# Altium project APSS_BreakoutBoard.PrjPcb
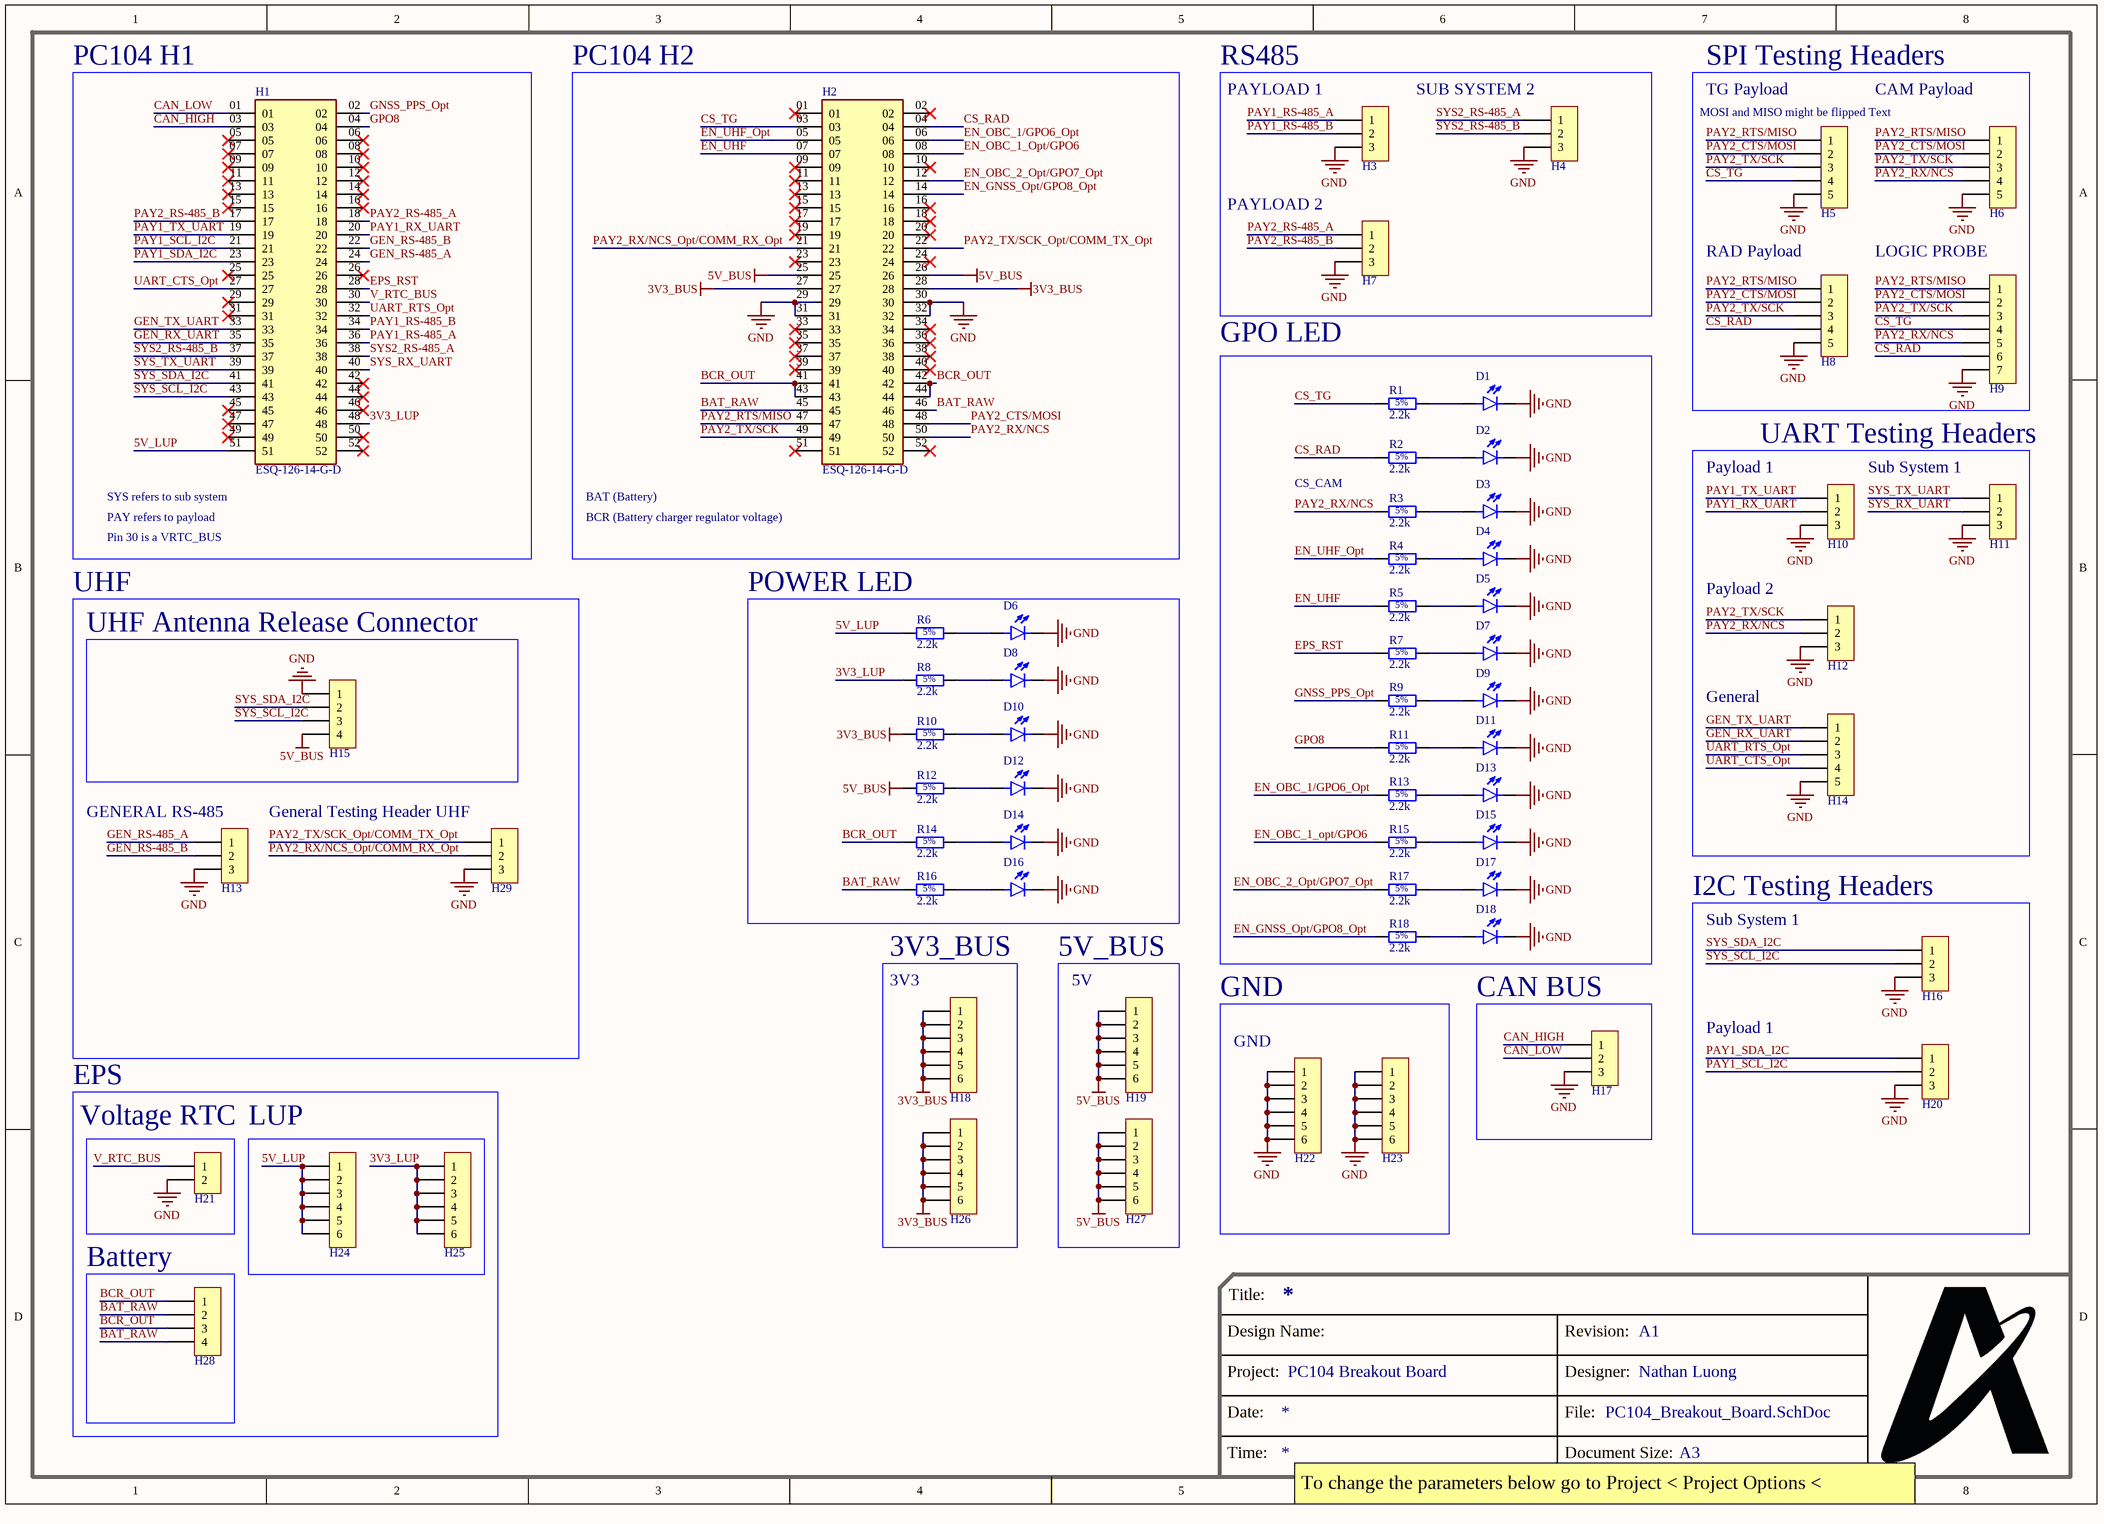
[diagram p0: PC104_Breakout_Board.SchDoc]
BoardRevision: A1; Designer: Nathan Luong; Project: PC104 Breakout Board
1 sheet, 65 parts. Net scope: global (net labels, ports and power ports of the same name join across sheets).
Board file: PC104_Breakout_Board.PcbDoc

## Sheet PC104_Breakout_Board.SchDoc
size A3; SheetNumber: 1; SheetTotal: 1

### Parts
D1  LTST-C190 Series  [LED_0603_1608M_0.80mm]  (value not drawn)
D2  LTST-C190 Series  [LED_0603_1608M_0.80mm]  (value not drawn)
D3  LTST-C190 Series  [LED_0603_1608M_0.80mm]  (value not drawn)
D4  LTST-C190 Series  [LED_0603_1608M_0.80mm]  (value not drawn)
D5  LTST-C190 Series  [LED_0603_1608M_0.80mm]  (value not drawn)
D6  LTST-C190 Series  [LED_0603_1608M_0.80mm]  (value not drawn)
D7  LTST-C190 Series  [LED_0603_1608M_0.80mm]  (value not drawn)
D8  LTST-C190 Series  [LED_0603_1608M_0.80mm]  (value not drawn)
D9  LTST-C190 Series  [LED_0603_1608M_0.80mm]  (value not drawn)
D10  LTST-C190 Series  [LED_0603_1608M_0.80mm]  (value not drawn)
D11  LTST-C190 Series  [LED_0603_1608M_0.80mm]  (value not drawn)
D12  LTST-C190 Series  [LED_0603_1608M_0.80mm]  (value not drawn)
D13  LTST-C190 Series  [LED_0603_1608M_0.80mm]  (value not drawn)
D14  LTST-C190 Series  [LED_0603_1608M_0.80mm]  (value not drawn)
D15  LTST-C190 Series  [LED_0603_1608M_0.80mm]  (value not drawn)
D16  LTST-C190 Series  [LED_0603_1608M_0.80mm]  (value not drawn)
D17  LTST-C190 Series  [LED_0603_1608M_0.80mm]  (value not drawn)
D18  LTST-C190 Series  [LED_0603_1608M_0.80mm]  (value not drawn)
H1  ESQ-126-14-G-D  [SAMTEC_ESQ-126-14-G-D]
H2  ESQ-126-14-G-D  [SAMTEC_ESQ-126-14-G-D]
H3  HDR,2.54mm,1x3  [HEADER_2.54MM_1x3PIN]  (value not drawn)  (no BOM)
H4  HDR,2.54mm,1x3  [HEADER_2.54MM_1x3PIN]  (value not drawn)  (no BOM)
H5  HDR,2.54mm,1x5  [HEADER_2.54MM_1x5PIN]  (value not drawn)  (no BOM)
H6  HDR,2.54mm,1x5  [HEADER_2.54MM_1x5PIN]  (value not drawn)  (no BOM)
H7  HDR,2.54mm,1x3  [HEADER_2.54MM_1x3PIN]  (value not drawn)  (no BOM)
H8  HDR,2.54mm,1x5  [HEADER_2.54MM_1x5PIN]  (value not drawn)  (no BOM)
H9  HDR,2.54mm,1x7  [HEADER_2.54MM_1x7PIN]  (value not drawn)  (no BOM)
H10  HDR,2.54mm,1x3  [HEADER_2.54MM_1x3PIN]  (value not drawn)  (no BOM)
H11  HDR,2.54mm,1x3  [HEADER_2.54MM_1x3PIN]  (value not drawn)  (no BOM)
H12  HDR,2.54mm,1x3  [HEADER_2.54MM_1x3PIN]  (value not drawn)  (no BOM)
H13  HDR,2.54mm,1x3  [HEADER_2.54MM_1x3PIN]  (value not drawn)  (no BOM)
H14  HDR,2.54mm,1x5  [HEADER_2.54MM_1x5PIN]  (value not drawn)  (no BOM)
H15  HDR,2.54mm,1x4  [HEADER_2.54MM_1x4PIN]  (value not drawn)  (no BOM)
H16  HDR,2.54mm,1x3  [HEADER_2.54MM_1x3PIN]  (value not drawn)  (no BOM)
H17  HDR,2.54mm,1x3  [HEADER_2.54MM_1x3PIN]  (value not drawn)  (no BOM)
H18  HDR,2.54mm,1x6  [HEADER_2.54MM_1x6PIN]  (value not drawn)  (no BOM)
H19  HDR,2.54mm,1x6  [HEADER_2.54MM_1x6PIN]  (value not drawn)  (no BOM)
H20  HDR,2.54mm,1x3  [HEADER_2.54MM_1x3PIN]  (value not drawn)  (no BOM)
H21  HDR,2.54mm,1x2  [HEADER_2.54MM_1x2PIN]  (value not drawn)  (no BOM)
H22  HDR,2.54mm,1x6  [HEADER_2.54MM_1x6PIN]  (value not drawn)  (no BOM)
H23  HDR,2.54mm,1x6  [HEADER_2.54MM_1x6PIN]  (value not drawn)  (no BOM)
H24  HDR,2.54mm,1x6  [HEADER_2.54MM_1x6PIN]  (value not drawn)  (no BOM)
H25  HDR,2.54mm,1x6  [HEADER_2.54MM_1x6PIN]  (value not drawn)  (no BOM)
H26  HDR,2.54mm,1x6  [HEADER_2.54MM_1x6PIN]  (value not drawn)  (no BOM)
H27  HDR,2.54mm,1x6  [HEADER_2.54MM_1x6PIN]  (value not drawn)  (no BOM)
H28  HDR,2.54mm,1x4  [HEADER_2.54MM_1x4PIN]  (value not drawn)  (no BOM)
H29  HDR,2.54mm,1x3  [HEADER_2.54MM_1x3PIN]  (value not drawn)  (no BOM)
R1  2.2k  [RESISTOR_0805_2012M-50N]
R2  2.2k  [RESISTOR_0805_2012M-50N]
R3  2.2k  [RESISTOR_0805_2012M-50N]
R4  2.2k  [RESISTOR_0805_2012M-50N]
R5  2.2k  [RESISTOR_0805_2012M-50N]
R6  2.2k  [RESISTOR_0805_2012M-50N]
R7  2.2k  [RESISTOR_0805_2012M-50N]
R8  2.2k  [RESISTOR_0805_2012M-50N]
R9  2.2k  [RESISTOR_0805_2012M-50N]
R10  2.2k  [RESISTOR_0805_2012M-50N]
R11  2.2k  [RESISTOR_0805_2012M-50N]
R12  2.2k  [RESISTOR_0805_2012M-50N]
R13  2.2k  [RESISTOR_0805_2012M-50N]
R14  2.2k  [RESISTOR_0805_2012M-50N]
R15  2.2k  [RESISTOR_0805_2012M-50N]
R16  2.2k  [RESISTOR_0805_2012M-50N]
R17  2.2k  [RESISTOR_0805_2012M-50N]
R18  2.2k  [RESISTOR_0805_2012M-50N]

### Blocks framed on the sheet
PC104 H1: H1
PC104 H2: H2
RS485: H3 H4 H7
SPI Testing Headers: H5 H6 H8 H9
GPO LED: D1-D5 D7 D9 D11 D13 D15 D17 D18 R1-R5 R7 R9 R11 R13 R15 R17 R18
UART Testing Headers: H10-H12 H14
UHF: H13 H29
POWER LED: D6 D8 D10 D12 D14 D16 R6 R8 R10 R12 R14 R16
UHF Antenna Release Connector: H15
I2C Testing Headers: H16 H20
3V3_BUS: H18 H26
5V_BUS: H19 H27
GND: H22 H23
CAN BUS: H17
LUP: H24 H25
Battery: H28

### Nets
3V3_BUS: H2.27 H2.28 H18.1 H18.2 H18.3 H18.4 H18.5 H18.6 H26.1 H26.2 H26.3 H26.4 H26.5 H26.6 R10.1
5V_BUS: H2.25 H2.26 H15.4 H19.1 H19.2 H19.3 H19.4 H19.5 H19.6 H27.1 H27.2 H27.3 H27.4 H27.5 H27.6 R12.1
GND: D1.C D2.C D3.C D4.C D5.C D6.C D7.C D8.C D9.C D10.C D11.C D12.C D13.C D14.C D15.C D16.C D17.C D18.C H2.29 H2.30 H2.31 H2.32 H3.3 H4.3 H5.5 H6.5 H7.3 H8.5 H9.7 H10.3 H11.3 H12.3 H13.3 H14.5 H15.1 H16.3 H17.3 H20.3 H21.2 H22.1 H22.2 H22.3 H22.4 H22.5 H22.6 H23.1 H23.2 H23.3 H23.4 H23.5 H23.6 H29.3
3V3_LUP: H1.48 H25.1 H25.2 H25.3 H25.4 H25.5 H25.6 R8.1
5V_LUP: H1.51 H24.1 H24.2 H24.3 H24.4 H24.5 H24.6 R6.1
.: H2.03 H5.4 H9.4 R1.1  [also labelled CS_TG]
BAT_RAW: H2.45 H2.46 H28.2 H28.4 R16.1
BCR_OUT: H2.41 H2.42 H2.43 H2.44 H28.1 H28.3 R14.1
CAN_HIGH: H1.03 H17.1
CAN_LOW: H1.01 H17.2
CS_RAD: H2.04 H8.4 H9.6 R2.1
EN_GNSS_Opt/GPO8_Opt: H2.14 R18.1
EN_OBC_1/GPO6_Opt: H2.06 R13.1
EN_OBC_1_Opt/GPO6: H2.08 R15.1
EN_OBC_2_Opt/GPO7_Opt: H2.12 R17.1
EN_UHF: H2.07 R5.1
EN_UHF_Opt: H2.05 R4.1
EPS_RST: H1.28 R7.1
GEN_RS-485_A: H1.24 H13.1
GEN_RS-485_B: H1.22 H13.2
GEN_RX_UART: H1.35 H14.2
GEN_TX_UART: H1.33 H14.1
GNSS_PPS_Opt: H1.02 R9.1
GPO8: H1.04 R11.1
PAY1_RS-485_A: H1.36 H3.1
PAY1_RS-485_B: H1.34 H3.2
PAY1_RX_UART: H1.20 H10.2
PAY1_SCL_I2C: H1.21 H20.2
PAY1_SDA_I2C: H1.23 H20.1
PAY1_TX_UART: H1.19 H10.1
PAY2_CTS/MOSI: H2.48 H5.2 H6.2 H8.2 H9.2
PAY2_RS-485_A: H1.18 H7.1
PAY2_RS-485_B: H1.17 H7.2
PAY2_RTS/MISO: H2.47 H5.1 H6.1 H8.1 H9.1
PAY2_RX/NCS: H2.50 H6.4 H9.5 H12.2 R3.1
PAY2_RX/NCS_Opt/COMM_RX_Opt: H2.21 H29.2
PAY2_TX/SCK: H2.49 H5.3 H6.3 H8.3 H9.3 H12.1
PAY2_TX/SCK_Opt/COMM_TX_Opt: H2.22 H29.1
SYS2_RS-485_A: H1.38 H4.1
SYS2_RS-485_B: H1.37 H4.2
SYS_RX_UART: H1.40 H11.2
SYS_SCL_I2C: H1.43 H15.3 H16.2
SYS_SDA_I2C: H1.41 H15.2 H16.1
SYS_TX_UART: H1.39 H11.1
UART_CTS_Opt: H1.27 H14.4
UART_RTS_Opt: H1.32 H14.3
V_RTC_BUS: H1.30 H21.1
NetD1_A: D1.A R1.2
NetD2_A: D2.A R2.2
NetD3_A: D3.A R3.2
NetD4_A: D4.A R4.2
NetD5_A: D5.A R5.2
NetD6_A: D6.A R6.2
NetD7_A: D7.A R7.2
NetD8_A: D8.A R8.2
NetD9_A: D9.A R9.2
NetD10_A: D10.A R10.2
NetD11_A: D11.A R11.2
NetD12_A: D12.A R12.2
NetD13_A: D13.A R13.2
NetD14_A: D14.A R14.2
NetD15_A: D15.A R15.2
NetD16_A: D16.A R16.2
NetD17_A: D17.A R17.2
NetD18_A: D18.A R18.2

Not connected (* = marked no-connect by the designer): H1 05* 06* 07* 08* 09* 10* 11* 12* 13* 14* 15* 16* 25* 26* 29* 31* 42* 44* 45* 46* 47* 49* 50* 52*; H2 01* 02* 09* 10* 11* 13* 15* 16* 17* 18* 19* 20* 23* 24* 33* 34* 35* 36* 37* 38* 39* 40* 51* 52*

### Notes on the sheet
- PAYLOAD 1
- SUB SYSTEM 2
- (near H5) TG Payload
- CAM Payload
- (near H5) MOSI and MISO might be flipped Text
- PAYLOAD 2
- RAD Payload
- LOGIC PROBE
- (near H1) SYS refers to sub system
- BAT (Battery)
- CS_CAM
- (near H10) Payload 1
- Sub System 1
- PAY refers to payload
- Pin 30 is a VRTC_BUS
- BCR (Battery charger regulator voltage)
- Payload 2
- General
- (near H13) GENERAL RS-485
- (near H29) General Testing Header UHF
- (near H18) 3V3
- (near H19) 5V
- (near H22) GND
- Payload 1
- EPS
- (near H21) Voltage RTC
- To change the parameters below go to Project < Project Options < Parameters
- Title:
- Design Name:
- Project:
- Revision:
- Designer:
- Date:
- Time:
- File:
- Document Size:
- A3

### Library data of the parts
D1-D18 = LTST-C190 Series: Diode - LED, 0603; APSS Standard Part: APSS Standard; Temp Range: -30°C ~ 85°C; Rated Voltage: 5V Reverse; Package: 0603; Supplier 1: Digikey
H1 H2 = ESQ-126-14-G-D: MF: Samtec; MP: ESQ-126-14-G-D; Price: None; Package: None; Value: *; Availability: Unavailable
H3 H4 H7 H10-H13 H16 H17 H20 H29 = HDR,2.54mm,1x3: Connector - 2.54mm, 1x3-pin
H5 H6 H8 H14 = HDR,2.54mm,1x5: Connector - 2.54mm, 1x5-pin
H9 = HDR,2.54mm,1x7: Connector - 2.54mm, 1x7-pin
H15 H28 = HDR,2.54mm,1x4: Connector - 2.54mm, 1x4-pin
H18 H19 H22-H27 = HDR,2.54mm,1x6: Connector - 2.54mm, 1x6-pin
H21 = HDR,2.54mm,1x2: Connector - 2.54mm, 1x2-pin
R1-R18 = Generic Resistor: Passive - Resistor, Generic; Tolerance: 5%; Value: 2.2k